# EAGLE design h2 (EAGLE 9.5.2)
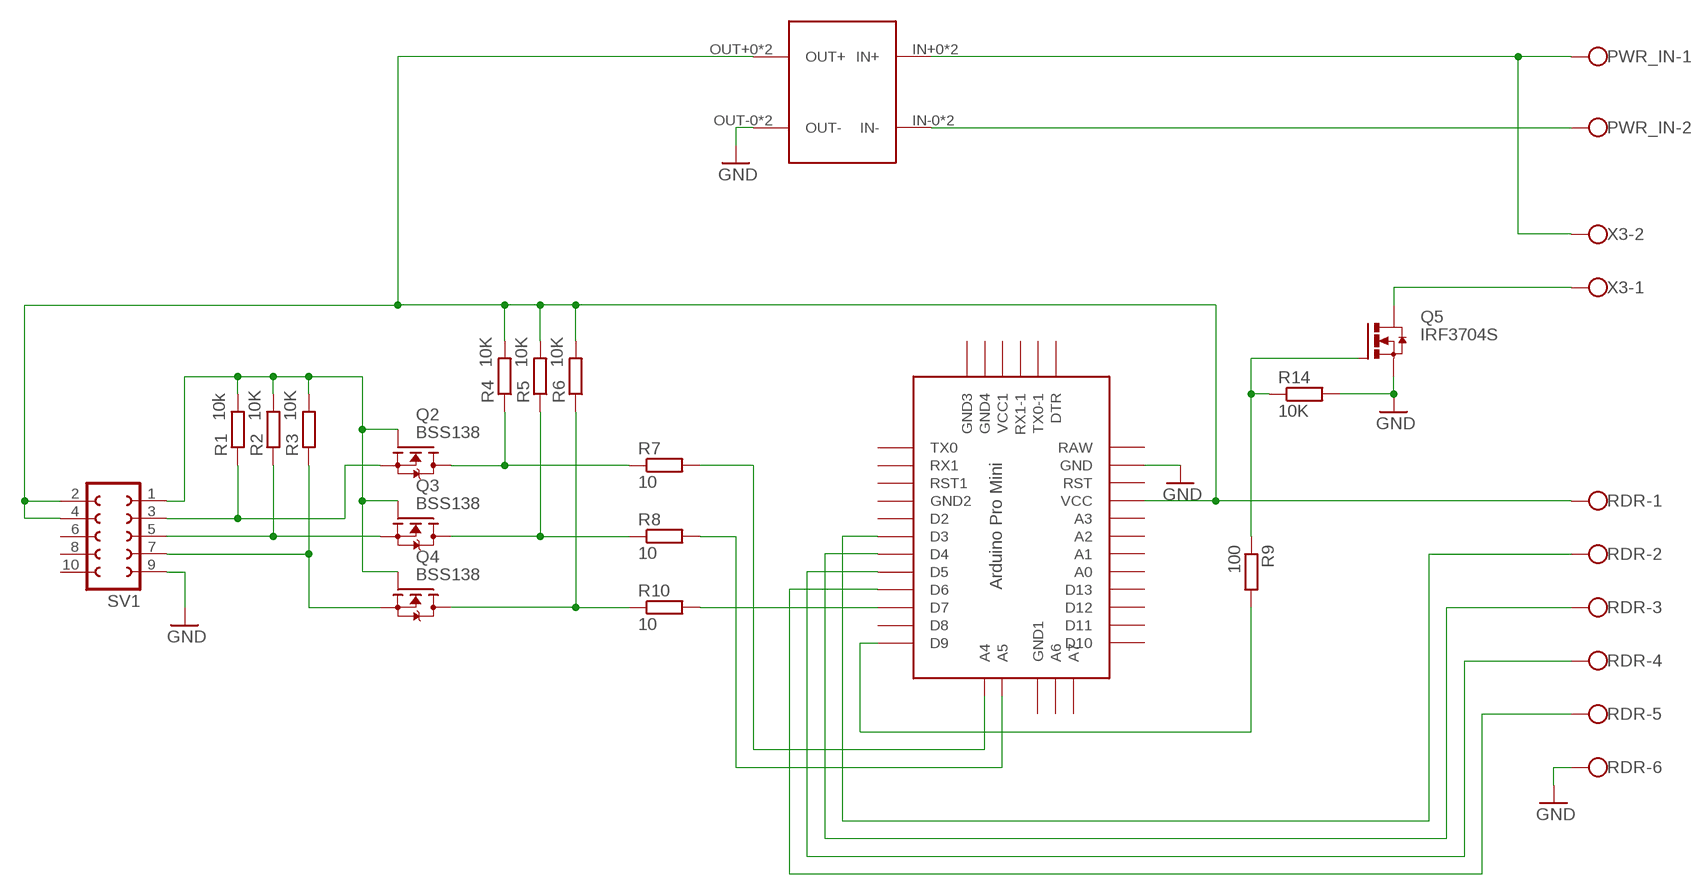
[diagram p0: schematic, sheet 1]

## Parts
PWR_IN  W237-102  [W237-102]
Q2  BSS138  [SOT23]
Q3  BSS138  [SOT23]
Q4  BSS138  [SOT23]
Q5  IRF3704S  [D2PACK]
R1  10k  R-EU_R1206  [R1206]
R2  10K  R-EU_R1206  [R1206]
R3  10K  R-EU_R1206  [R1206]
R4  10K  R-EU_R1206  [R1206]
R5  10K  R-EU_R1206  [R1206]
R6  10K  R-EU_R1206  [R1206]
R7  10  R-EU_R1206  [R1206]
R8  10  R-EU_R1206  [R1206]
R9  100  R-EU_R1206  [R1206]
R10  10  R-EU_R1206  [R1206]
R14  10K  R-EU_R1206  [R1206]
RDR  W237-136  [W237-136]
SV1  FE05-2  [FE05-2]
U$1  DC/DC4.5-20-ADJ  [23X17_8P]
U$4  ABK-PRO-MINI  [ABK-PRO-MINI]
X3  W237-102  [W237-102]

## Nets
GND: Q5.3(S) R14.2 RDR.6 SV1.9 U$1.OUT-0(OUT-) U$1.OUT-1(OUT-) U$4.GND
N$1: Q2.2(S) R1.1 SV1.3
N$2: Q2.1(G) Q3.1(G) Q4.1(G) R1.2 R2.2 R3.2 SV1.1
N$3: Q2.3(D) R4.1 R7.1
N$4: Q3.2(S) R2.1 SV1.5
N$5: Q4.2(S) R3.1 SV1.7
N$6: R8.2 U$4.A5
N$7: RDR.2 U$4.D3
N$8: R4.2 R5.2 R6.2 RDR.1 SV1.2 SV1.4 U$1.OUT+0(OUT+) U$1.OUT+1(OUT+) U$4.VCC
N$9: R10.2 U$4.D7
N$10: Q3.3(D) R5.1 R8.1
N$11: Q4.3(D) R6.1 R10.1
N$18: R7.2 U$4.A4
N$22: PWR_IN.2 U$1.IN-0(IN-) U$1.IN-1(IN-)
N$27: Q5.2(D) X3.1
N$28: R9.2 U$4.D9
N$29: Q5.1(G) R9.1 R14.1
N$33: RDR.3 U$4.D4
N$34: RDR.4 U$4.D5
N$35: RDR.5 U$4.D6
PWR+12: PWR_IN.1 U$1.IN+0(IN+) U$1.IN+1(IN+) X3.2
Unconnected: SV1.6 SV1.8 SV1.10 U$4.A0 U$4.A1 U$4.A2 U$4.A3 U$4.A6 U$4.A7 U$4.D2 U$4.D8 U$4.D10 U$4.D11 U$4.D12 U$4.D13 U$4.DTR U$4.GND1(GND2) U$4.GND2(GND3) U$4.GND3(GND4) U$4.GND4(GND1) U$4.RAW U$4.RST U$4.RST1 U$4.RX1 U$4.RX1-1 U$4.TX0 U$4.TX0-1 U$4.VCC1

## Library data of the parts
PWR_IN X3 = con-wago-500:W237-102: WAGO SCREW CLAMP; MPN: 237-102; OC_FARNELL: unknown; OC_NEWARK: 70K9898
Q2-Q4 = bss138_10:BSS138: BSS138 N-Channel Logic Level Enhancement Mode Field Effect Transistor Source: http://www.fairchildsemi.com/datasheets/BS/BSS138.pdf; MF: Fairchild; MPN: BSS138; OC_FARNELL: 9845330; OC_NEWARK: 67R2009
Q5 = transistor-power:IRF3704: SMPS MOSFET HEXFET® Power MOSFET Source: http://www.irf.com/product-info/datasheets/data/irf3704.pdf
R1-R10 R14 = resistor:R-EU_: RESISTOR, European symbol
RDR = con-wago-500:W237-136: WAGO SCREW CLAMP; MPN: 237-136; OC_FARNELL: unknown; OC_NEWARK: 84K9151
SV1 = con-lsta:FE05-2: FEMALE HEADER; OC_FARNELL: unknown; OC_NEWARK: unknown
U$1 = bra_lib:DC/DC4.5-20-ADJ: DC/DC Step Down converter DC/DC4.5-20-ADJ Size :23х17mm Adjustable In 4.5-20 Volts Out 0.8-20 Volts 3 Amp max
U$4 = bra_lib:ABK-PRO-MINI: ABK Pro-Mini Arduino Clone

## Board
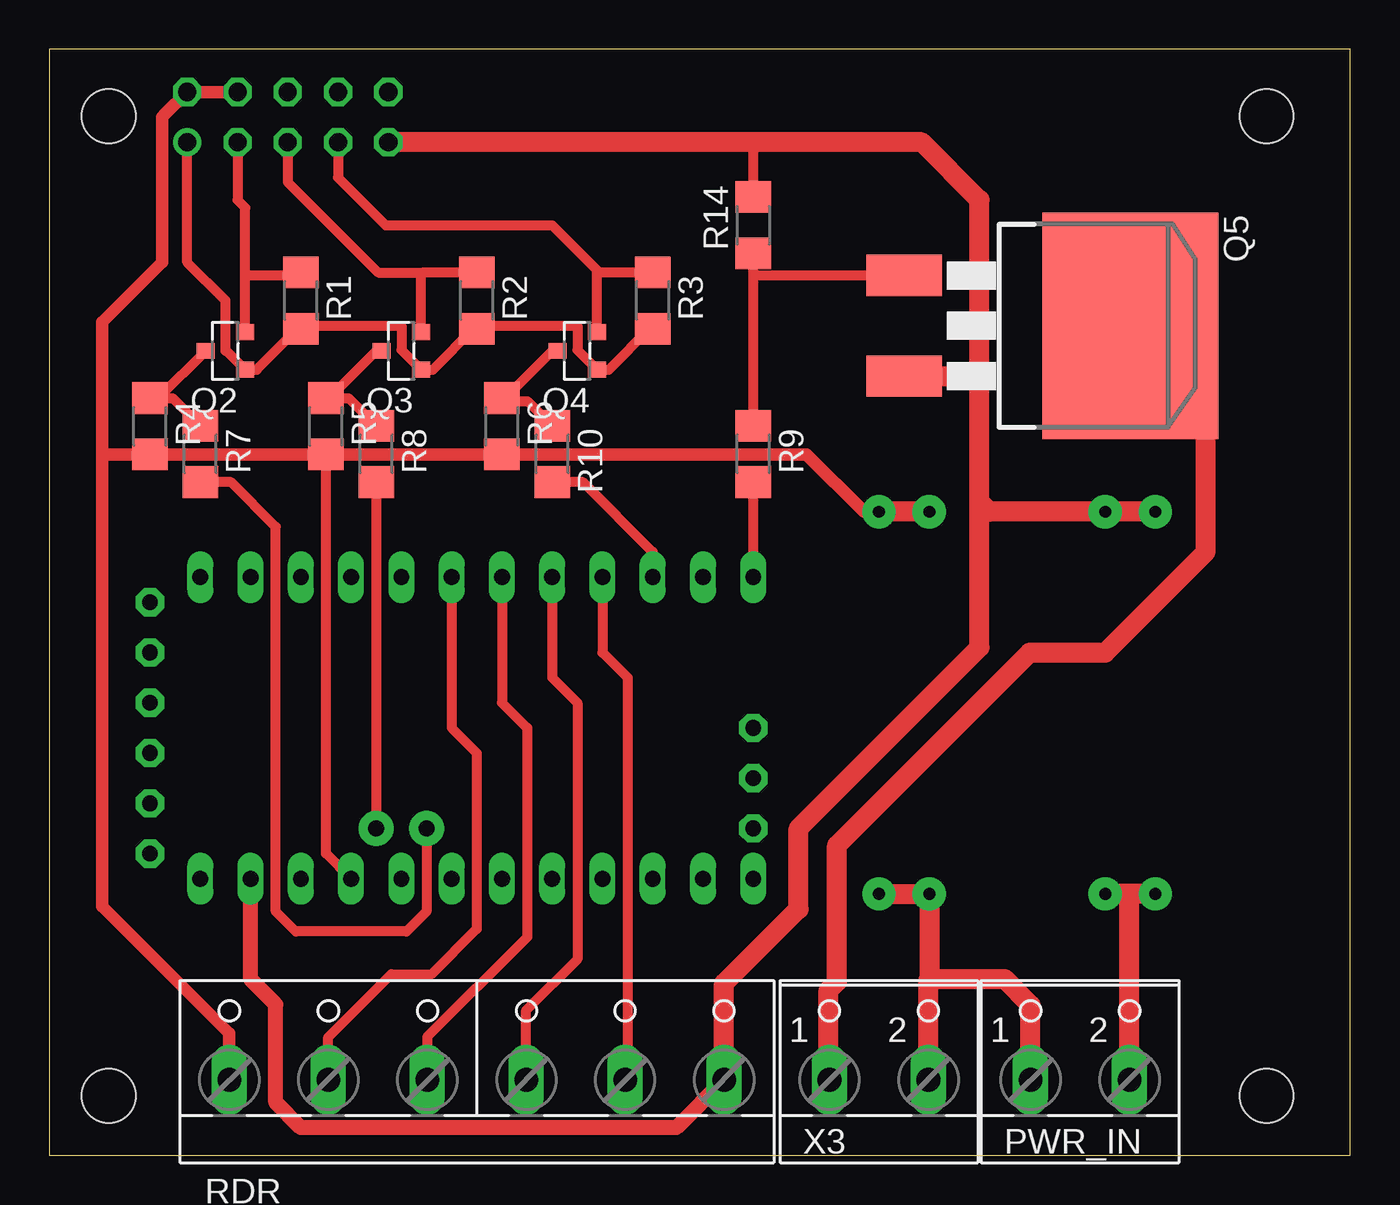
[diagram p1: board, top side]
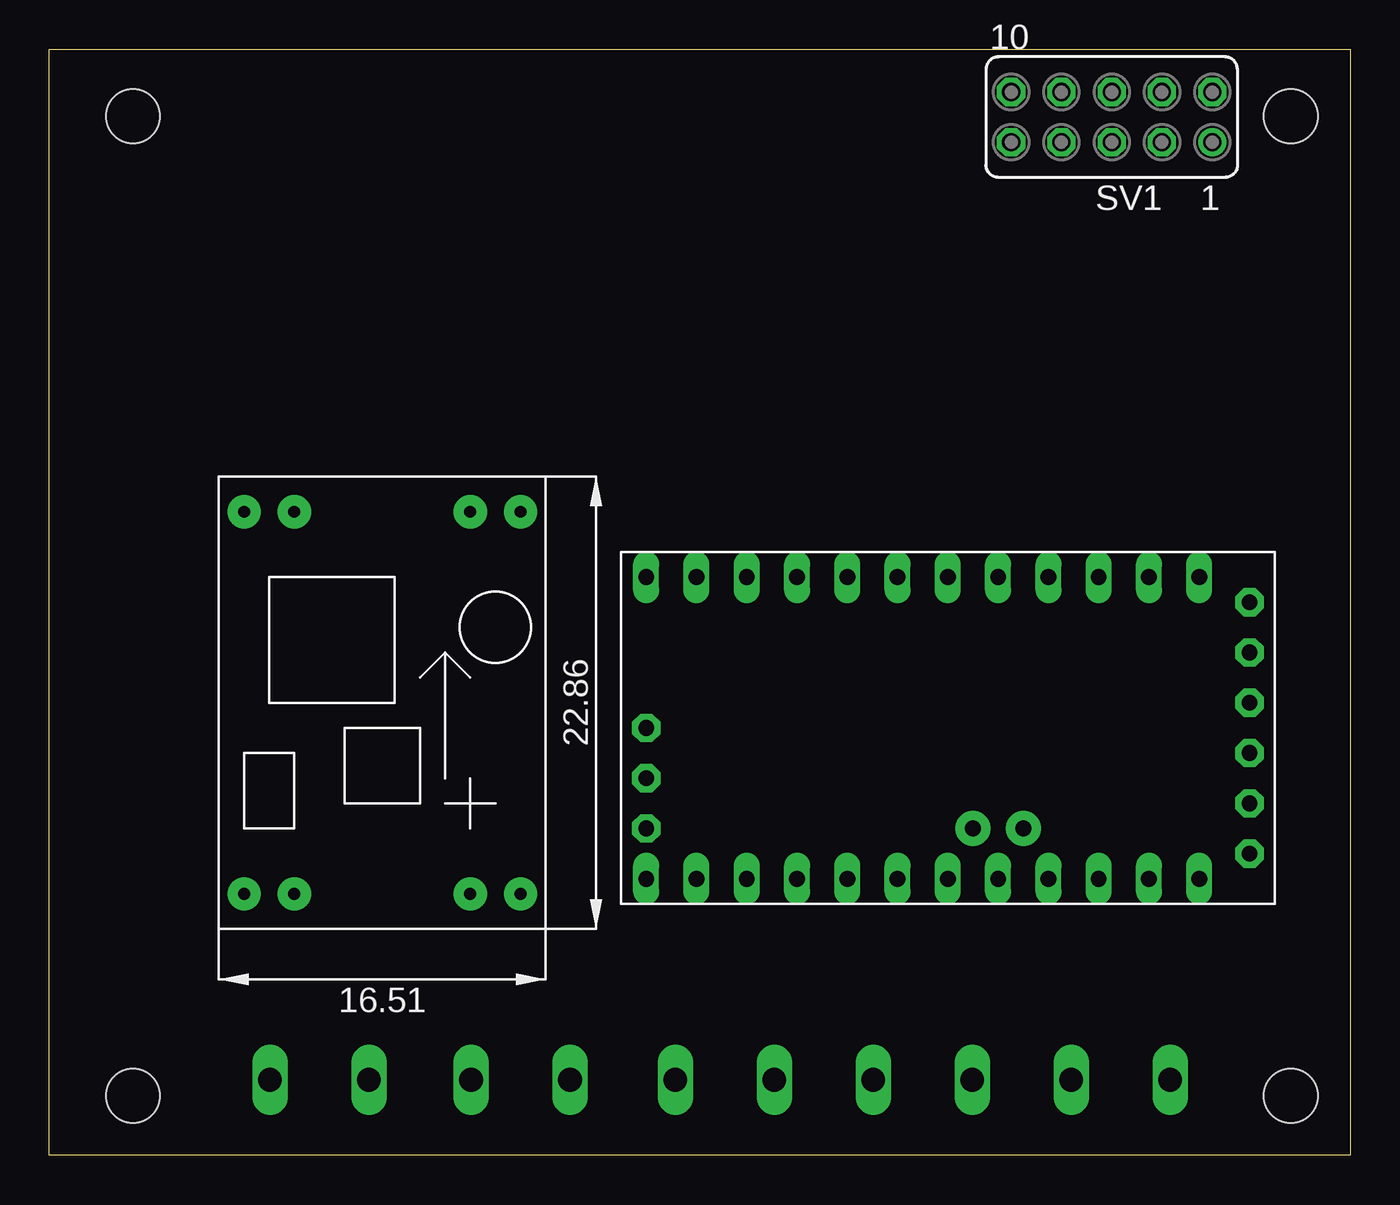
[diagram p2: board, bottom side, seen from below]

Size 65.71 x 55.87 mm. Coordinates in mm from the lower left corner, seen from the top.
Outline: 0,0 65.71,0 65.71,55.87 0,55.87 0,0
Copper layers (1*16): Top 0.035mm / dielectric 1.5mm / Bottom 0.035mm
Design rules "default": minimum track width 6mil, minimum drill 0.35mm, track to track 6mil, track to pad 6mil, pad to pad 6mil, via to via 6mil, smd to smd 6mil, copper to edge 40mil, drill to drill 6mil, minimum pad ring 10mil, minimum via ring 8mil, stop-mask expansion 4mil, vias tented up to drill 0mil, thermal gap 10mil
Holes 2.72 mm at 3,3 3,52.5 61.49,3 61.49,52.5

### Footprints (pad centres in the part's own frame; a part is rotated, then mirrored left to right if it is on the bottom)
W237-102 = drill 1.194 long: 1 -2.5,-1.27; 2 2.5,-1.27
SOT23 = smd 0.8 x 0.9: 1 -0.95,-1; 2 0.95,-1; 3 0,1
D2PACK = smd 2.083 x 3.81: 1 -2.54,-8.89; 3 2.54,-8.89 | smd 11.43 x 8.89: 2 0,2.54
R1206 = smd 1.6 x 1.803: 1 -1.422,0; 2 1.422,0
W237-136 = drill 1.194 long: 1 -12.5,-1.27; 2 -7.5,-1.27; 3 -2.5,-1.27; 4 2.5,-1.27; 5 7.5,-1.27; 6 12.5,-1.27
FE05-2 = drill 0.914: 1 -5.08,1.27 | drill 0.914 octagon: 2 -5.08,-1.27; 3 -2.54,1.27; 4 -2.54,-1.27; 5 0,1.27; 6 0,-1.27; 7 2.54,1.27; 8 2.54,-1.27; 9 5.08,1.27; 10 5.08,-1.27
23X17_8P = drill 0.6 pad 1.676: IN+0 -14.732,-2.54; IN+1 -14.732,0; IN-0 -14.732,11.43; IN-1 -14.732,8.89; OUT+0 4.572,-2.54; OUT+1 4.572,0; OUT-0 4.572,11.43; OUT-1 4.572,8.89
ABK-PRO-MINI = drill 0.8 long: A0 7.62,2.54; A1 7.62,0; A2 7.62,-2.54; A3 7.62,-5.08; D2 -7.62,2.54; D3 -7.62,0; D4 -7.62,-2.54; D5 -7.62,-5.08; D6 -7.62,-7.62; D7 -7.62,-10.16; D8 -7.62,-12.7; D9 -7.62,-15.24; D10 7.62,-15.24; D11 7.62,-12.7; D12 7.62,-10.16; D13 7.62,-7.62; GND 7.62,10.16; GND1 -7.62,5.08; RAW 7.62,12.7; RST 7.62,7.62; RST1 -7.62,7.62; RX1 -7.62,10.16; TX0 -7.62,12.7; VCC 7.62,5.08 | drill 0.8 pad 1.778: A4 5.08,1.27; A5 5.08,3.81 | drill 0.8 pad 1.422 octagon: A6 2.54,-15.24; A7 5.08,-15.24; DTR 6.35,15.24; GND2 -6.35,15.24; GND3 -3.81,15.24; GND4 0,-15.24; RX1-1 1.27,15.24; TX0-1 3.81,15.24; VCC1 -1.27,15.24

### Placement (x,y rotation side)
PWR_IN  52.07,5.08 0 top
Q2  8.89,40.64 90 top
Q3  17.78,40.64 90 top
Q4  26.67,40.64 90 top
Q5  52.07,41.91 270 top
R1  12.7,43.18 270 top
R2  21.59,43.18 270 top
R3  30.48,43.18 270 top
R4  5.08,36.83 270 top
R5  13.97,36.83 270 top
R6  22.86,36.83 270 top
R7  7.62,35.43 270 top
R8  16.51,35.43 270 top
R9  35.56,35.43 270 top
R10  25.4,35.43 270 top
R14  35.56,46.99 90 top
RDR  21.59,5.08 0 top
SV1  12.04,52.45 180 bottom
U$1  44.45,27.94 90 bottom
U$4  20.32,21.59 270 bottom
X3  41.91,5.08 0 top

### Tracks (layer width: path | path; a pad name or v marks a point on that pad's centre or on a via)
GND
  Top 0.508: R14.2 35.56,51.18
  Top 0.762: RDR.6 31.68,1.4 12.7,1.4 11.43,2.67 11.43,7.62 10.16,8.89 U$4.GND
  Top 1.016: RDR.6 34.09,8.69 37.85,12.45 37.85,16.51 46.99,25.65 46.99,33.02 | 46.99,33.02 46.99,39.37 | 46.99,39.37 46.99,48.26 44.07,51.18 35.56,51.18 SV1.9 | Q5.3 46.99,39.37 | U$1.OUT-0 U$1.OUT-1 47.5,32.51 46.99,33.02
N$1
  Top 0.508: Q2.2 9.89,44.45 | R1.1 12.55,44.45 9.89,44.45 | SV1.3 9.5,48.26 9.89,47.87 9.89,44.45
N$2
  Top 0.508: R3.2 30.33,41.76 28.26,39.69 Q4.1 26.67,40.69 26.67,41.91 21.74,41.91 R2.2 21.44,41.76 19.37,39.69 Q3.1 17.78,40.69 17.78,41.91 12.85,41.91 R1.2 12.55,41.76 10.48,39.69 Q2.1 8.94,40.64 8.89,40.64 8.89,43.18 6.96,45.11 SV1.1
N$3
  Top 0.508: Q2.3 5.5,38.25 R4.1 6.22,38.25 R7.1
N$4
  Top 0.508: R2.1 18.9,44.6 | SV1.5 12.04,49.17 16.61,44.6 18.9,44.6 | Q3.2 18.78,44.48 18.9,44.6
N$5
  Top 0.508: Q4.2 27.67,44.72 | 27.67,44.72 25.4,46.99 16.99,46.99 14.58,49.4 SV1.7 | R3.1 27.79,44.6 27.67,44.72
N$6
  Top 0.508: R8.2 U$4.A5
N$7
  Top 0.508: U$4.D3 20.32,21.59 21.59,20.32 21.59,11.43 19.3,9.14 17.27,9.14 14.09,5.96 RDR.2
N$8
  Top 0.508: U$4.VCC 13.97,15.24 R5.2 | 5.83,52.59 5.63,52.39
  Top 0.635: U$1.OUT+0 41.15,32.51 38.25,35.41 R6.2 R5.2 R4.2 2.69,35.41 2.67,35.43 | 2.67,35.43 2.67,42.1 5.69,45.13 5.69,52.45 5.83,52.59 SV1.2 SV1.4 | 2.67,35.43 2.67,12.57 9.09,6.15 RDR.1
  Top 1.016: U$1.OUT+1 U$1.OUT+0
N$9
  Top 0.508: U$4.D7 30.48,30.48 26.95,34.01 R10.2
N$10
  Top 0.508: Q3.3 16.51,40.64 14.12,38.25 R5.1 15.11,38.25 R8.1
N$11
  Top 0.508: Q4.3 25.4,40.64 23.01,38.25 R6.1 23.01,38.1 24.16,38.1 R10.1
N$18
  Top 0.508: U$4.A4 19.05,12.32 18.03,11.3 12.45,11.3 11.43,12.32 11.43,31.75 9.17,34.01 R7.2
N$22
  Top 1.016: U$1.IN-0 54.61,13.21 | 54.61,13.21 U$1.IN-1 | PWR_IN.2 54.57,13.17 54.61,13.21
N$27
  Top 0.508: 57.15,39.37 Q5.2
  Top 1.016: 57.15,39.37 58.42,38.1 58.42,30.48 53.34,25.4 49.53,25.4 39.79,15.66 39.79,8.76 39.37,8.34 39.37,3.85 X3.1
N$28
  Top 0.508: U$4.D9 R9.2
N$29
  Top 0.508: R9.1 35.56,44.45 | 35.56,44.45 R14.1 | Q5.1 35.56,44.45
N$33
  Top 0.508: U$4.D4 22.86,22.86 24.13,21.59 24.13,11.01 19.09,5.97 RDR.3
N$34
  Top 0.508: U$4.D5 25.4,24.13 26.67,22.86 26.67,9.91 24.09,7.33 RDR.4
N$35
  Top 0.508: U$4.D6 27.94,25.4 29.21,24.13 29.21,3.93 RDR.5
PWR+12
  Top 1.016: PWR_IN.1 49.57,7.58 48.26,8.89 44.41,8.89 | X3.2 44.41,8.89 | U$1.IN+0 U$1.IN+1 44.45,8.93 44.41,8.89